# Altium schematic sheet USB_To_UART.SchDoc
size A4
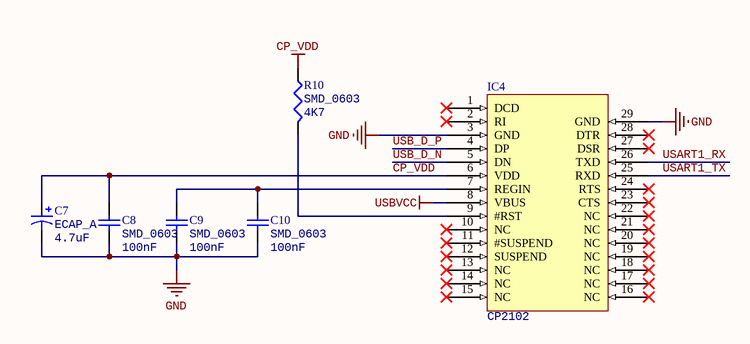
[diagram p0: USB_To_UART.SchDoc]

## Parts
C7  ECAP_A  value 4.7uF  [CAPAE4645X63M]
C8  SMD_0603  value 100nF  [1608[0603]]
C9  SMD_0603  value 100nF  [1608[0603]]
C10  SMD_0603  value 100nF  [1608[0603]]
IC4  CP2102  [QFN28]
R10  SMD_0603  value 4K7  [J1-0603]

## Nets
CP_VDD: C7.1 C8.2 IC4.6(VDD) R10.1
GND: C7.2 C8.1 C9.1 C10.1 IC4.3(GND) IC4.29(GND)
USBVCC: IC4.8(VBUS)
USART1_RX: IC4.26(TXD)
USART1_TX: IC4.25(RXD)
USB_D_N: IC4.5(DN)
USB_D_P: IC4.4(DP)
NetC9_2: C9.2 C10.2 IC4.7(REGIN)
NetIC4_9: IC4.9(#RST) R10.2

Not connected (* = marked no-connect by the designer): IC4 1(DCD)* 2(RI)* 10(NC)* 11(#SUSPEND)* 12(SUSPEND)* 13(NC)* 14(NC)* 15(NC)* 16(NC)* 17(NC)* 18(NC)* 19(NC)* 20(NC)* 21(NC)* 22(NC)* 23(CTS)* 24(RTS)* 27(DSR)* 28(DTR)*

## Library data of the parts
C7 = Cap Pol1: Polarized Capacitor (Radial); Published: 8-Jun-2000; LatestRevisionDate: 17-Jul-2002; LatestRevisionNote: Re-released for DXP Platform.; PackageReference: RB7.6-15; Publisher: Altium Limited; PackageDescription: Polarized Capacitor (Radial); 2 Leads
C8-C10 = Cap Semi: Capacitor (Semiconductor SIM Model); Published: 8-Jun-2000; LatestRevisionDate: 29-May-2009; LatestRevisionNote: IPC-7351 Footprint Added.; PackageReference: C1206; Publisher: Altium Limited; PackageDescription: Chip Capacitor
IC4 = CP2102: Silabs CP2102
R10 = Res3: Resistor; Published: 8-Jun-2000; LatestRevisionDate: 29-May-2009; LatestRevisionNote: IPC-7351 Footprint Added.; PackageReference: J1-0603; Publisher: Altium Limited; PackageDescription: Chip Resistor